# Altium schematic sheet Master.SchDoc
size 420 x 297 mm; SheetNumber: 1; SheetTotal: 6
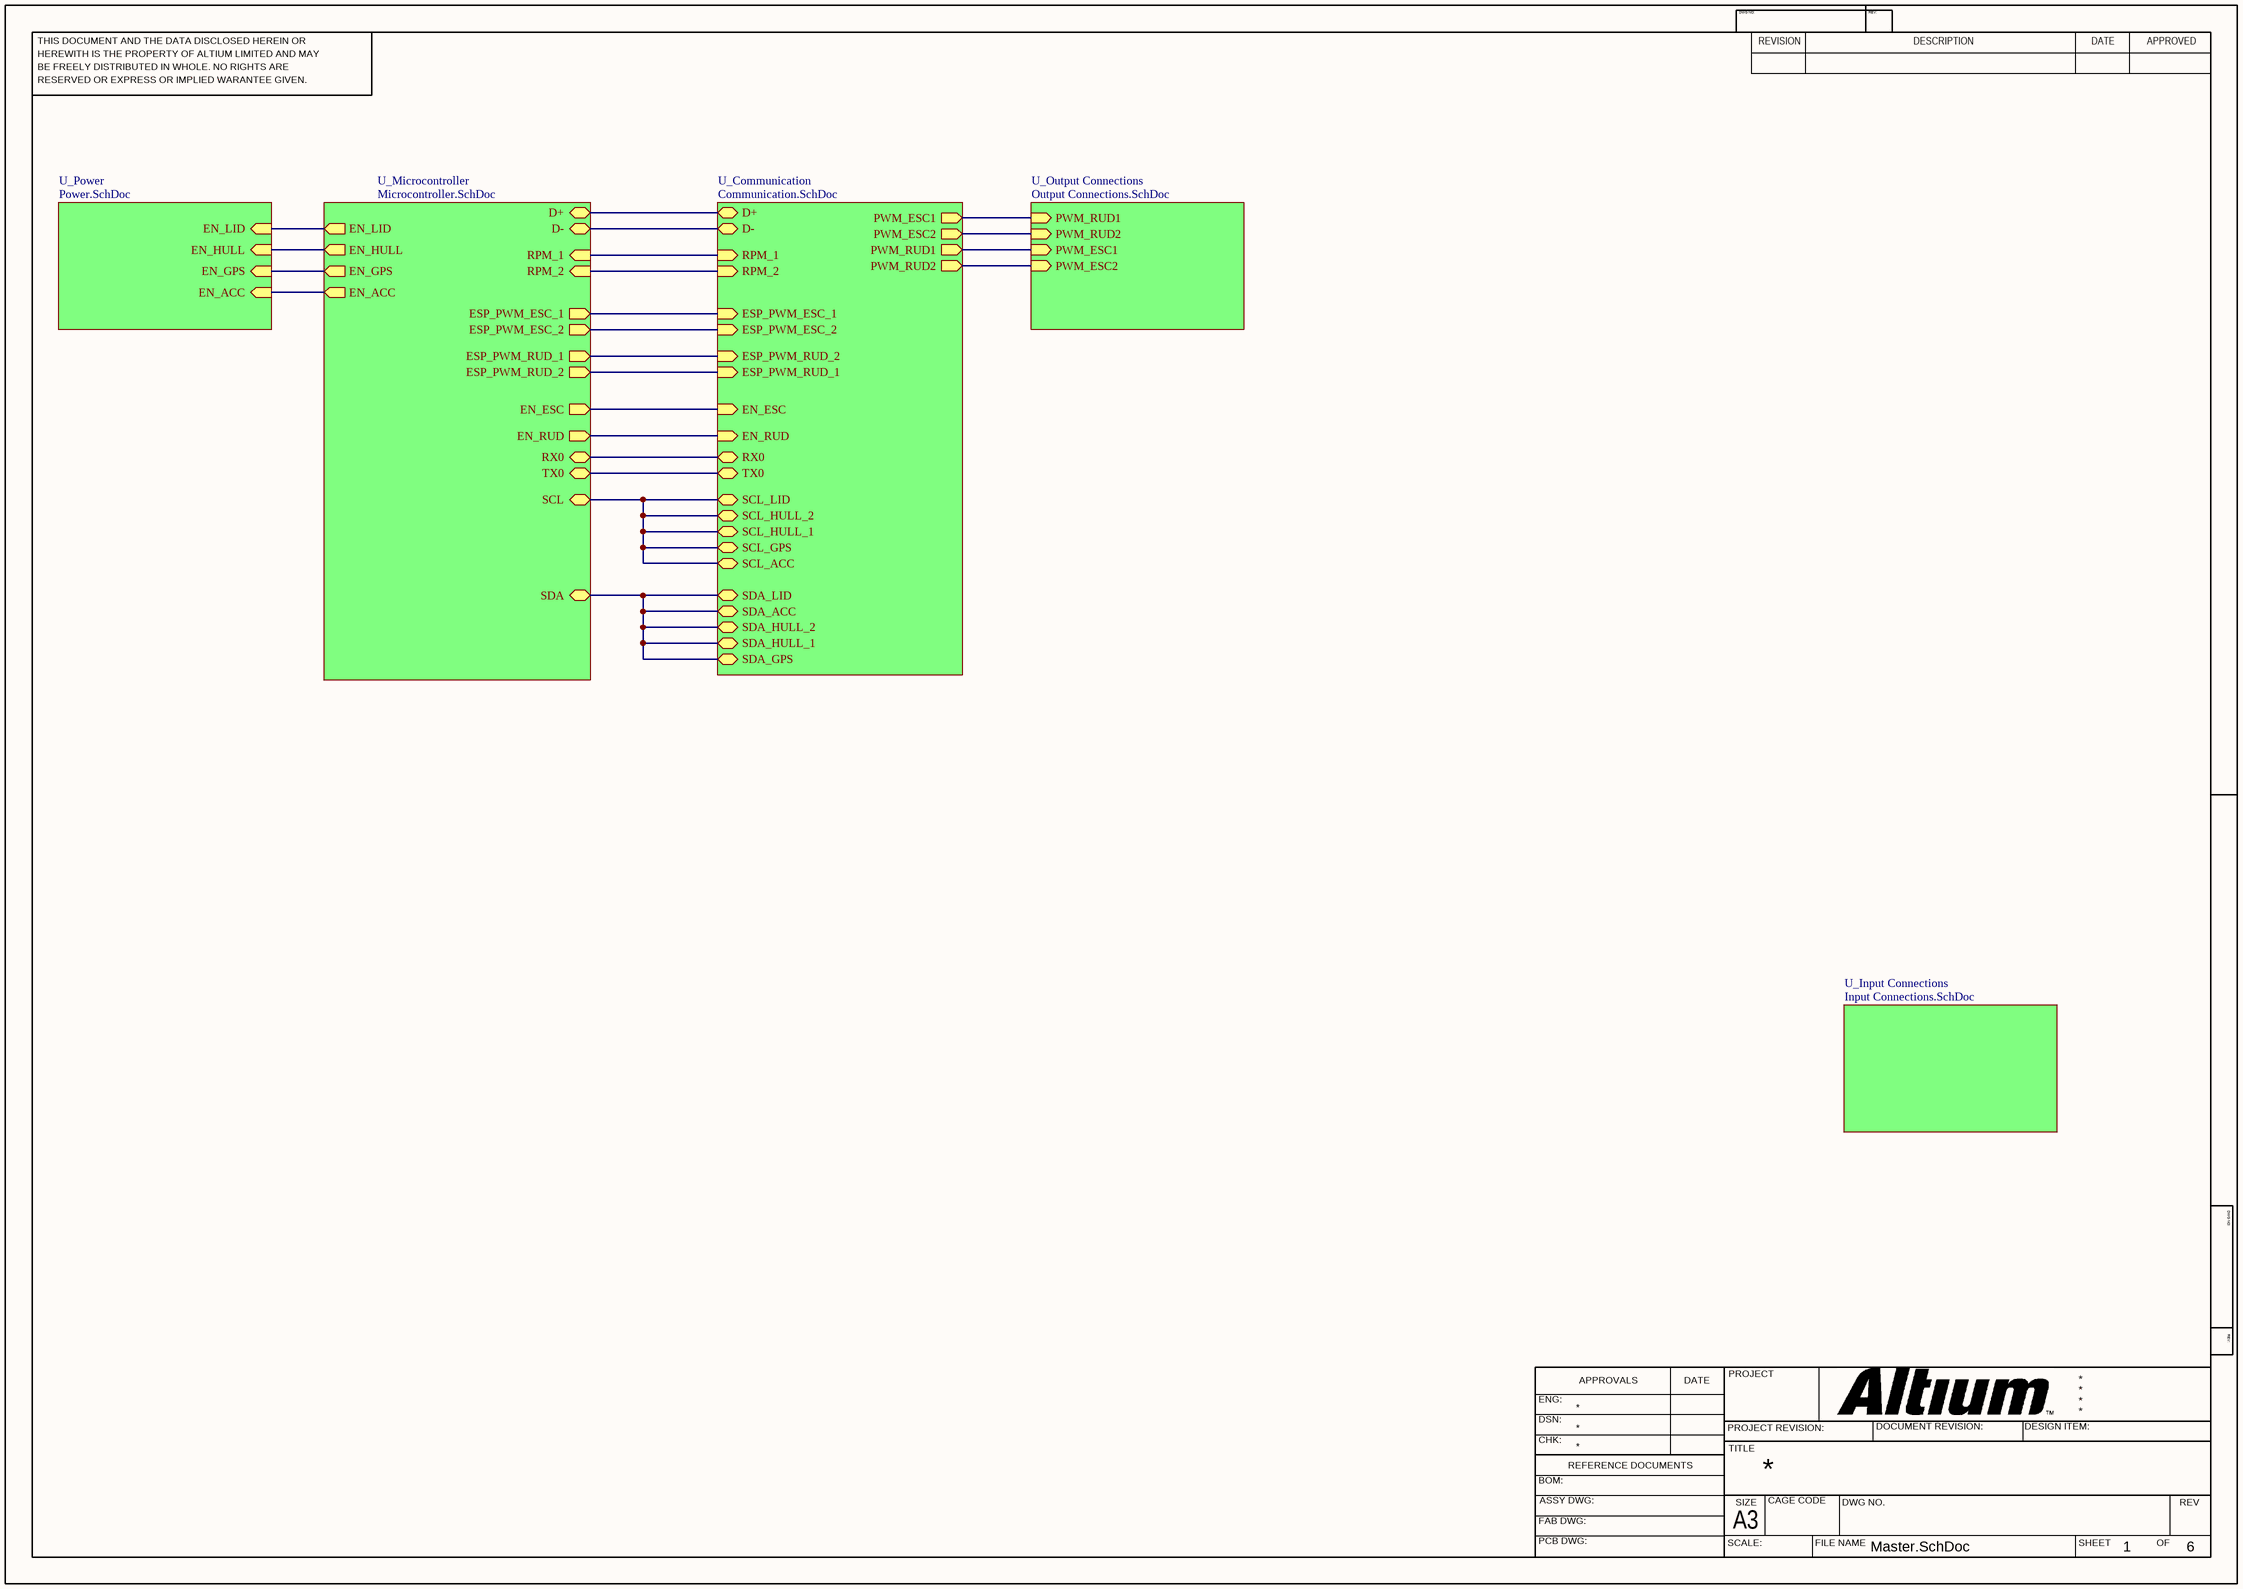
[diagram p0: Master.SchDoc]

## Sub-sheets
U_Communication = Communication.SchDoc: SDA_LID (bidir), RPM_1 (in), SCL_ACC (bidir), SDA_ACC (bidir), SCL_GPS (bidir), SDA_HULL_2 (bidir), SCL_HULL_2 (bidir), RPM_2 (in), SCL_HULL_1 (bidir), SDA_HULL_1 (bidir), SCL_LID (bidir), SDA_GPS (bidir), PWM_ESC1 (out), EN_ESC (in), ESP_PWM_ESC_1 (in), PWM_ESC2 (out), ESP_PWM_ESC_2 (in), PWM_RUD1 (out), ESP_PWM_RUD_1 (in), PWM_RUD2 (out), ESP_PWM_RUD_2 (in), EN_RUD (in), D+ (bidir), D- (bidir), RX0 (bidir), TX0 (bidir)
U_Input Connections = Input Connections.SchDoc: no entries
U_Microcontroller = Microcontroller.SchDoc: SDA (bidir), SCL (bidir), RPM_1 (in), RPM_2 (in), ESP_PWM_RUD_1 (out), ESP_PWM_RUD_2 (out), ESP_PWM_ESC_1 (out), ESP_PWM_ESC_2 (out), EN_LID (out), EN_HULL (out), EN_GPS (out), EN_ACC (out), EN_ESC (out), EN_RUD (out), D- (bidir), D+ (bidir), TX0 (bidir), RX0 (bidir)
U_Output Connections = Output Connections.SchDoc: PWM_RUD1 (in), PWM_RUD2 (in), PWM_ESC1 (in), PWM_ESC2 (in)
U_Power = Power.SchDoc: EN_LID (in), EN_HULL (in), EN_GPS (in), EN_ACC (in)

## Nets
(unnamed): sheet U_Power/EN_LID, sheet U_Microcontroller/EN_LID
(unnamed): sheet U_Power/EN_HULL, sheet U_Microcontroller/EN_HULL
(unnamed): sheet U_Power/EN_GPS, sheet U_Microcontroller/EN_GPS
(unnamed): sheet U_Power/EN_ACC, sheet U_Microcontroller/EN_ACC
(unnamed): sheet U_Microcontroller/SDA, sheet U_Communication/SDA_LID, sheet U_Communication/SDA_ACC, sheet U_Communication/SDA_HULL_2, sheet U_Communication/SDA_HULL_1, sheet U_Communication/SDA_GPS
(unnamed): sheet U_Microcontroller/SCL, sheet U_Communication/SCL_ACC, sheet U_Communication/SCL_GPS, sheet U_Communication/SCL_HULL_2, sheet U_Communication/SCL_HULL_1, sheet U_Communication/SCL_LID
(unnamed): sheet U_Microcontroller/RPM_1, sheet U_Communication/RPM_1
(unnamed): sheet U_Microcontroller/RPM_2, sheet U_Communication/RPM_2
(unnamed): sheet U_Microcontroller/ESP_PWM_RUD_1, sheet U_Communication/ESP_PWM_RUD_2
(unnamed): sheet U_Microcontroller/ESP_PWM_RUD_2, sheet U_Communication/ESP_PWM_RUD_1
(unnamed): sheet U_Microcontroller/ESP_PWM_ESC_1, sheet U_Communication/ESP_PWM_ESC_1
(unnamed): sheet U_Microcontroller/ESP_PWM_ESC_2, sheet U_Communication/ESP_PWM_ESC_2
(unnamed): sheet U_Microcontroller/EN_ESC, sheet U_Communication/EN_ESC
(unnamed): sheet U_Microcontroller/EN_RUD, sheet U_Communication/EN_RUD
(unnamed): sheet U_Microcontroller/D-, sheet U_Communication/D-
(unnamed): sheet U_Microcontroller/D+, sheet U_Communication/D+
(unnamed): sheet U_Microcontroller/TX0, sheet U_Communication/TX0
(unnamed): sheet U_Microcontroller/RX0, sheet U_Communication/RX0
(unnamed): sheet U_Communication/PWM_ESC1, sheet U_Output Connections/PWM_RUD1
(unnamed): sheet U_Communication/PWM_ESC2, sheet U_Output Connections/PWM_RUD2
(unnamed): sheet U_Communication/PWM_RUD1, sheet U_Output Connections/PWM_ESC1
(unnamed): sheet U_Communication/PWM_RUD2, sheet U_Output Connections/PWM_ESC2

## Notes on the sheet
- THIS DOCUMENT AND THE DATA DISCLOSED HEREIN OR
- HEREWITH IS THE PROPERTY OF ALTIUM LIMITED AND MAY
- DWG NO:
- REVISION
- REV:
- DESCRIPTION
- DATE
- APPROVED
- BE FREELY DISTRIBUTED IN WHOLE. NO RIGHTS ARE
- RESERVED OR EXPRESS OR IMPLIED WARANTEE GIVEN.
- ENG:
- APPROVALS
- PROJECT
- DSN:
- CHK:
- REFERENCE DOCUMENTS
- PROJECT REVISION:
- TITLE
- DOCUMENT REVISION:
- DESIGN ITEM:
- BOM:
- FAB DWG:
- PCB DWG:
- ASSY DWG:
- SCALE:
- A3
- SIZE
- CAGE CODE
- FILE NAME
- DWG NO.
- SHEET
- OF
- REV